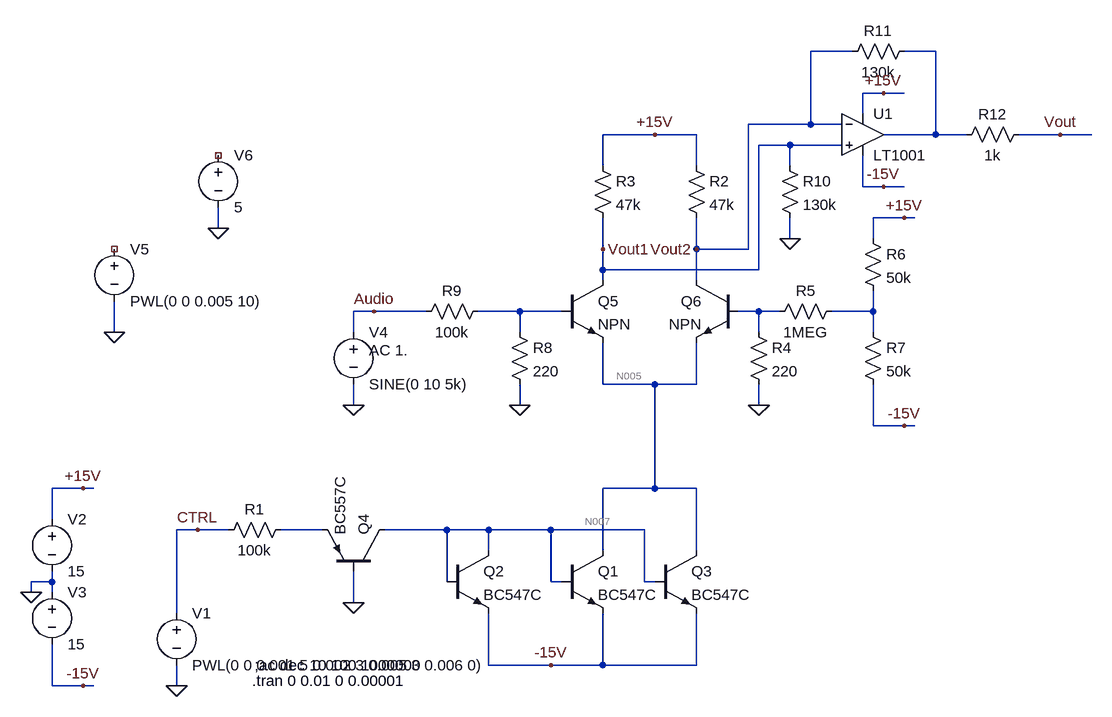
[diagram p0: schematic simulation.asc]
simulation.asc, the LTspice schematic file:
Version 4
SHEET 1 1108 680
WIRE 704 -592 640 -592
WIRE 832 -592 784 -592
WIRE 752 -528 720 -528
WIRE 784 -528 752 -528
WIRE 720 -496 720 -528
WIRE 640 -480 640 -592
WIRE 640 -480 544 -480
WIRE 688 -480 640 -480
WIRE 400 -464 320 -464
WIRE 464 -464 400 -464
WIRE 832 -464 832 -592
WIRE 832 -464 752 -464
WIRE 880 -464 832 -464
WIRE 1024 -464 960 -464
WIRE 1072 -464 1024 -464
WIRE 608 -448 560 -448
WIRE 688 -448 608 -448
WIRE 320 -416 320 -464
WIRE 464 -416 464 -464
WIRE 608 -416 608 -448
WIRE 720 -384 720 -432
WIRE 752 -384 720 -384
WIRE 784 -384 752 -384
WIRE 784 -336 736 -336
WIRE 800 -336 784 -336
WIRE -272 -320 -272 -352
WIRE 608 -304 608 -336
WIRE 736 -304 736 -336
WIRE 320 -288 320 -336
WIRE 464 -288 464 -336
WIRE 544 -288 544 -480
WIRE 544 -288 464 -288
WIRE 320 -256 320 -288
WIRE 560 -256 560 -448
WIRE 560 -256 320 -256
WIRE 320 -240 320 -256
WIRE 464 -240 464 -288
WIRE -32 -192 -64 -192
WIRE 48 -192 -32 -192
WIRE 192 -192 128 -192
WIRE 256 -192 192 -192
WIRE 560 -192 528 -192
WIRE 592 -192 560 -192
WIRE 736 -192 736 -224
WIRE 736 -192 672 -192
WIRE -432 -160 -432 -208
WIRE -64 -160 -64 -192
WIRE 192 -160 192 -192
WIRE 560 -160 560 -192
WIRE 736 -160 736 -192
WIRE 320 -80 320 -144
WIRE 400 -80 320 -80
WIRE 464 -80 464 -144
WIRE 464 -80 400 -80
WIRE -64 -48 -64 -80
WIRE 192 -48 192 -80
WIRE 560 -48 560 -80
WIRE 736 -16 736 -80
WIRE 784 -16 736 -16
WIRE 800 -16 784 -16
WIRE -480 80 -528 80
WIRE -464 80 -480 80
WIRE 400 80 400 -80
WIRE 400 80 320 80
WIRE 464 80 400 80
WIRE -528 128 -528 80
WIRE -304 144 -336 144
WIRE -256 144 -304 144
WIRE -112 144 -176 144
WIRE 80 144 -16 144
WIRE 144 144 80 144
WIRE 240 144 144 144
WIRE 384 144 240 144
WIRE 144 176 144 144
WIRE 320 176 320 80
WIRE 464 176 464 80
WIRE -528 224 -528 208
WIRE -528 224 -560 224
WIRE 80 224 80 144
WIRE 240 224 240 144
WIRE 256 224 240 224
WIRE 384 224 384 144
WIRE 400 224 384 224
WIRE -560 240 -560 224
WIRE -528 240 -528 224
WIRE -64 256 -64 208
WIRE -336 272 -336 144
WIRE 144 352 144 272
WIRE 240 352 144 352
WIRE 320 352 320 272
WIRE 320 352 240 352
WIRE 464 352 464 272
WIRE 464 352 320 352
WIRE -528 384 -528 320
WIRE -480 384 -528 384
WIRE -464 384 -480 384
WIRE -336 384 -336 352
FLAG 240 352 -15V
FLAG -64 256 0
FLAG -336 384 0
FLAG -560 240 0
FLAG -480 384 -15V
FLAG -480 80 +15V
FLAG 560 -48 0
FLAG 784 -336 +15V
FLAG 784 -16 -15V
FLAG -64 -48 0
FLAG 192 -48 0
FLAG 400 -464 +15V
FLAG 320 -288 Vout1
FLAG 464 -288 Vout2
FLAG 608 -304 0
FLAG 752 -528 +15V
FLAG 752 -384 -15V
FLAG 1024 -464 Vout
FLAG -304 144 CTRL
FLAG -32 -192 Audio
FLAG -272 -320 0
FLAG -432 -160 0
SYMBOL npn 400 176 R0
SYMATTR InstName Q3
SYMATTR Value BC547C
SYMBOL pnp -16 208 M270
SYMATTR InstName Q4
SYMATTR Value BC557C
SYMBOL res -272 160 R270
WINDOW 0 32 56 VTop 2
WINDOW 3 0 56 VBottom 2
SYMATTR InstName R1
SYMATTR Value 100k
SYMBOL voltage -336 256 R0
WINDOW 123 0 0 Left 2
WINDOW 39 0 0 Left 2
SYMATTR InstName V1
SYMATTR Value PWL(0 0 0.001 5 0.002 3 0.005 3 0.006 0)
SYMBOL npn 256 176 R0
SYMATTR InstName Q1
SYMATTR Value BC547C
SYMBOL npn 80 176 R0
SYMATTR InstName Q2
SYMATTR Value BC547C
SYMBOL voltage -528 112 R0
SYMATTR InstName V2
SYMATTR Value 15
SYMBOL voltage -528 224 R0
SYMATTR InstName V3
SYMATTR Value 15
SYMBOL npn 256 -240 R0
SYMATTR InstName Q5
SYMBOL npn 528 -240 M0
SYMATTR InstName Q6
SYMBOL res 448 -432 R0
SYMATTR InstName R2
SYMATTR Value 47k
SYMBOL res 304 -432 R0
SYMATTR InstName R3
SYMATTR Value 47k
SYMBOL res 544 -176 R0
SYMATTR InstName R4
SYMATTR Value 220
SYMBOL res 576 -176 R270
WINDOW 0 32 56 VTop 2
WINDOW 3 0 56 VBottom 2
SYMATTR InstName R5
SYMATTR Value 1MEG
SYMBOL res 720 -320 R0
SYMATTR InstName R6
SYMATTR Value 50k
SYMBOL res 720 -176 R0
SYMATTR InstName R7
SYMATTR Value 50k
SYMBOL res 176 -176 R0
SYMATTR InstName R8
SYMATTR Value 220
SYMBOL res 32 -176 R270
WINDOW 0 32 56 VTop 2
WINDOW 3 0 56 VBottom 2
SYMATTR InstName R9
SYMATTR Value 100k
SYMBOL voltage -64 -176 R0
WINDOW 123 24 44 Left 2
WINDOW 39 0 0 Left 2
SYMATTR InstName V4
SYMATTR Value SINE(0 10 5k)
SYMATTR Value2 AC 1.
SYMBOL Opamps\\LT1001 720 -528 R0
SYMATTR InstName U1
SYMBOL res 592 -432 R0
SYMATTR InstName R10
SYMATTR Value 130k
SYMBOL res 688 -576 R270
WINDOW 0 32 56 VTop 2
WINDOW 3 0 56 VBottom 2
SYMATTR InstName R11
SYMATTR Value 130k
SYMBOL res 864 -448 R270
WINDOW 0 32 56 VTop 2
WINDOW 3 0 56 VBottom 2
SYMATTR InstName R12
SYMATTR Value 1k
SYMBOL voltage -432 -304 R0
WINDOW 123 0 0 Left 2
WINDOW 39 0 0 Left 2
SYMATTR InstName V5
SYMATTR Value PWL(0 0 0.005 10)
SYMBOL voltage -272 -448 R0
SYMATTR InstName V6
SYMATTR Value 5
TEXT -220 376 Left 2 !.tran 0 0.01 0 0.00001
TEXT -216 352 Left 2 !;ac dec 10 100 1000000

The netlist it stands for:
* simulation.asc
Q3 N005 N007 -15V 0 BC547C
Q4 N007 0 N006 0 BC557C
R1 CTRL N006 100k
V1 CTRL 0 PWL(0 0 0.001 5 0.002 3 0.005 3 0.006 0)
Q1 N005 N007 -15V 0 BC547C
Q2 N007 N007 -15V 0 BC547C
V2 +15V 0 15
V3 0 -15V 15
Q5 Vout1 N002 N005 0 NPN
Q6 Vout2 N003 N005 0 NPN
R2 +15V Vout2 47k
R3 +15V Vout1 47k
R4 N003 0 220
R5 N003 N004 1MEG
R6 +15V N004 50k
R7 N004 -15V 50k
R8 N002 0 220
R9 Audio N002 100k
V4 Audio 0 SINE(0 10 5k) AC 1.
XU1 Vout1 Vout2 +15V -15V N001 LT1001  ; pins In+ In- V+ V- OUT
R10 Vout1 0 130k
R11 Vout2 N001 130k
R12 N001 Vout 1k
V5 NC_01 0 PWL(0 0 0.005 10)
V6 NC_02 0 5
.model NPN NPN
.model PNP PNP
.lib standard.bjt
.tran 0 0.01 0 0.00001
;ac dec 10 100 1000000
.lib LTC.lib
.backanno
.end

* Results of the author's LTspice run, read from the files saved beside the schematic
* Operating Point, zero values left out:
*   V(n005) = -347.3 mV
*   V(n007) = -14.82 V
*   V(-15v) = -15 V
*   V(+15v) = 15 V
*   V(vout1) = 11.02 V
*   V(vout2) = 11.02 V
*   Ic(Q6) = 78.81 pA
*   Ib(Q6) = -9.992 pA
*   Ie(Q6) = -68.81 pA
*   Ic(Q5) = 78.81 pA
*   Ib(Q5) = -9.992 pA
*   Ie(Q5) = -68.81 pA
*   Ic(Q4) = -14.96 pA
*   Ib(Q4) = 14.87 pA
*   Ic(Q2) = 42.55 pA
*   Ie(Q2) = -43.01 pA
*   Ic(Q1) = 68.81 pA
*   Ib(Q1) = -14.03 pA
*   Ie(Q1) = -54.79 pA
*   Ic(Q3) = 68.81 pA
*   Ib(Q3) = -14.03 pA
*   Ie(Q3) = -54.79 pA
*   I(R11) = 84.75 µA
*   I(R10) = 84.75 µA
*   I(R8) = 9.97 pA
*   I(R7) = 300 µA
*   I(R6) = 300 µA
*   I(R4) = 9.99 pA
*   I(R3) = 84.75 µA
*   I(R2) = 84.75 µA
*   I(V3) = -2.593 mA
*   I(V2) = -2.677 mA
*   Ix(u1:1) = 19.67 pA
*   Ix(u1:2) = 19.67 pA
*   Ix(u1:3) = 2.208 mA
*   Ix(u1:4) = -2.293 mA
*   Ix(u1:5) = 84.75 µA
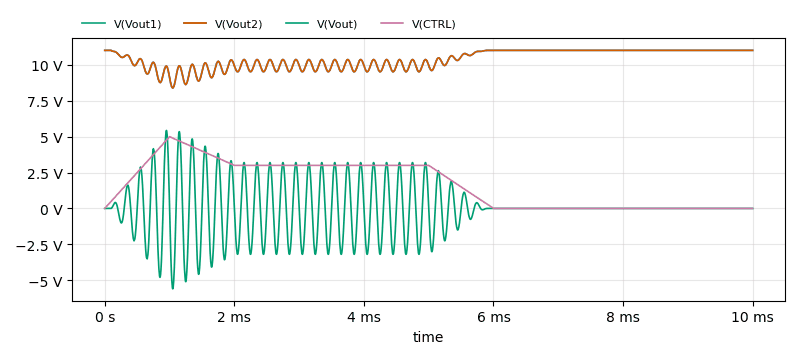
[diagram p1: Transient Analysis of simulation.asc, plotted from the saved traces]
* Transient Analysis, 1 run:
*   V(Vout1): min 8.398 V, max 11.02 V, average 10.42 V, rms 10.44 V, last 11.02 V
*   V(Vout2): min 8.4 V, max 11.02 V, average 10.42 V, rms 10.44 V, last 11.02 V
*   V(Vout): min -5.601 V, max 5.436 V, average 378 µV, rms 1.801 V, last 1.266 µV
*   V(CTRL): min 0 V, max 5 V, average 1.7 V, rms 2.338 V, last 0 V